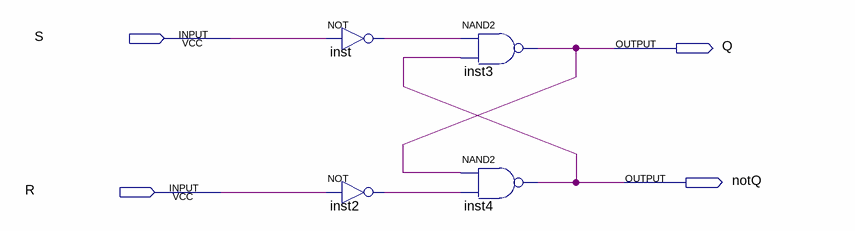
[diagram p0: schematic sheet]
// Quartus schematic SR_LATCH.bdf as structural Verilog: 4 symbols, 4 pins
module SR_LATCH (
  input  S,
  input  R,
  output Q,
  output notQ
);

  wire inst2_out, inst_out;

  not inst (inst_out, S);
  not inst2 (inst2_out, R);
  nand inst3 (Q, inst_out, notQ);
  nand inst4 (notQ, Q, inst2_out);
endmodule
